# Altium schematic sheet NEOS_CAN.SchDoc: NEOS USB to CAN
size Tabloid; PageSetup: Record=PageOptions|CenterHorizontal=True|CenterVertical=True|PrintScale=0.51|XCorrection=1.00|YCorrection=1.00|PrintKind=1|BorderSize=5000000|LeftOffset=0|BottomOffset=0|Orientation=2|PaperLength=1000|PaperWidth=1000|Scale=100|PaperSource=15|PrintQuality=1200|MediaType=1|DitherType=10|PaperKind=11x17|PrintScaleMode=1
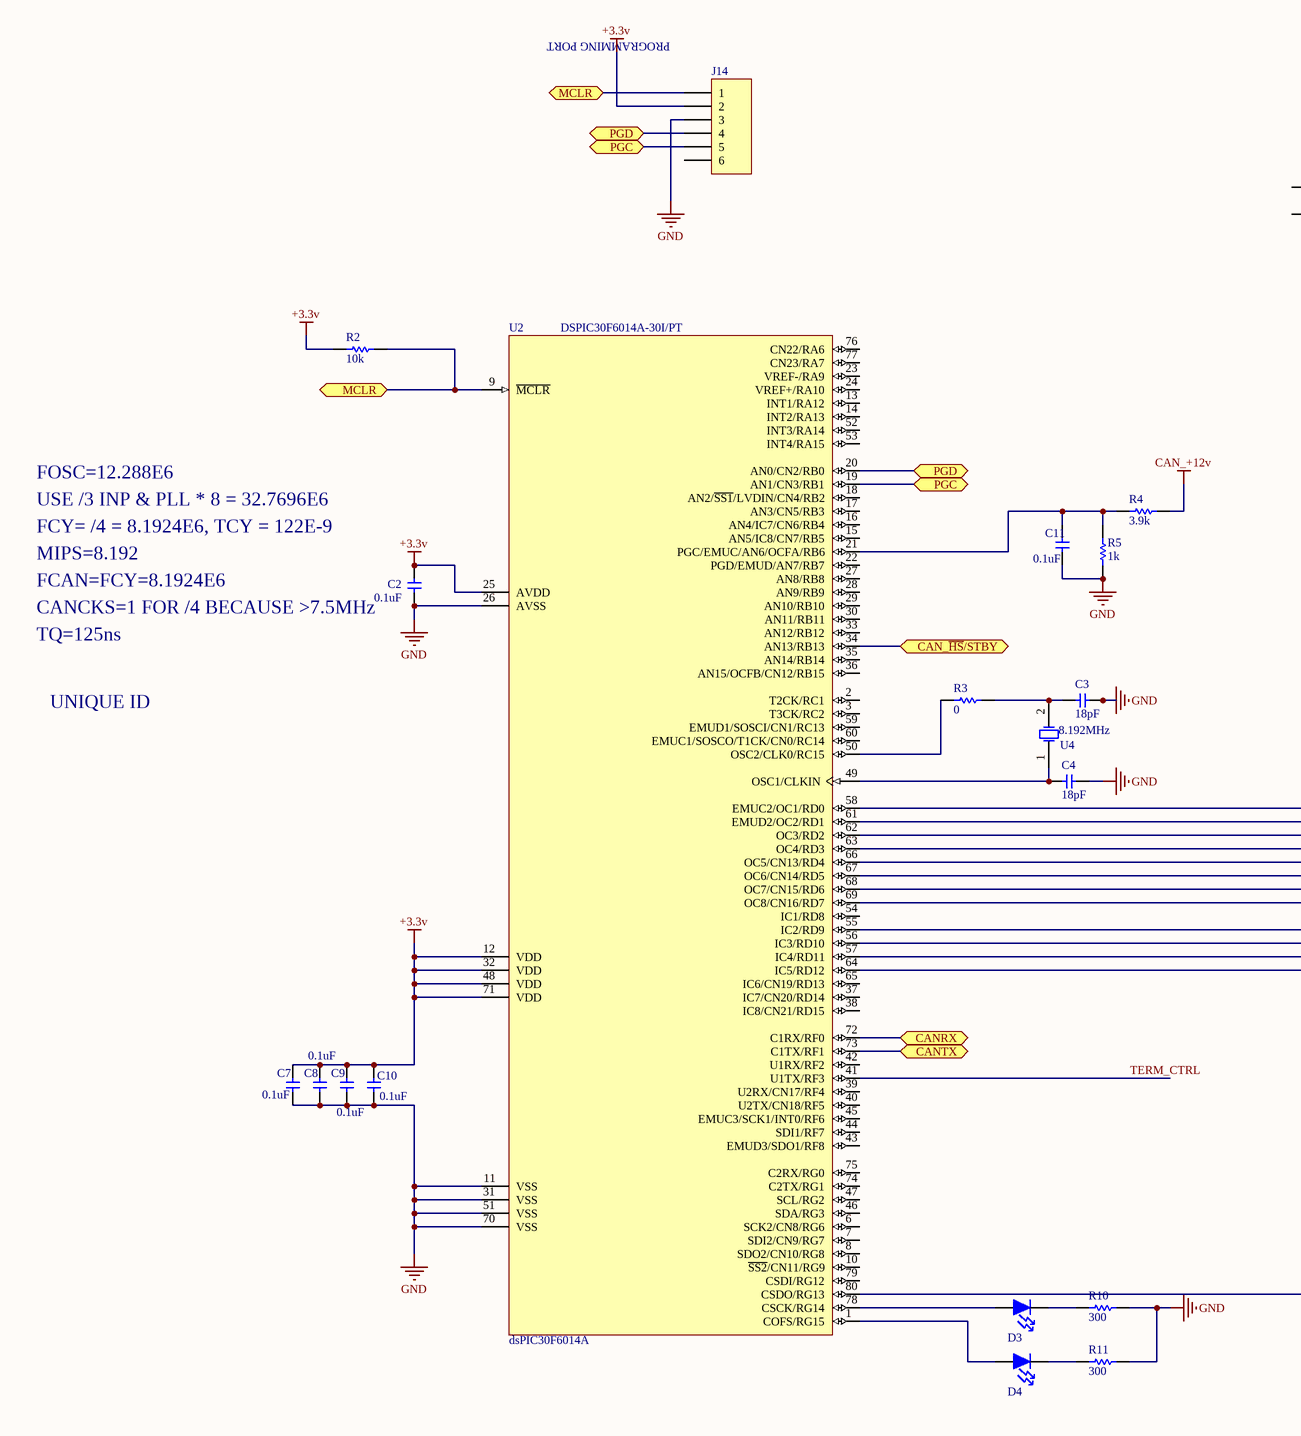
[diagram p0: NEOS_CAN.SchDoc, bottom left]
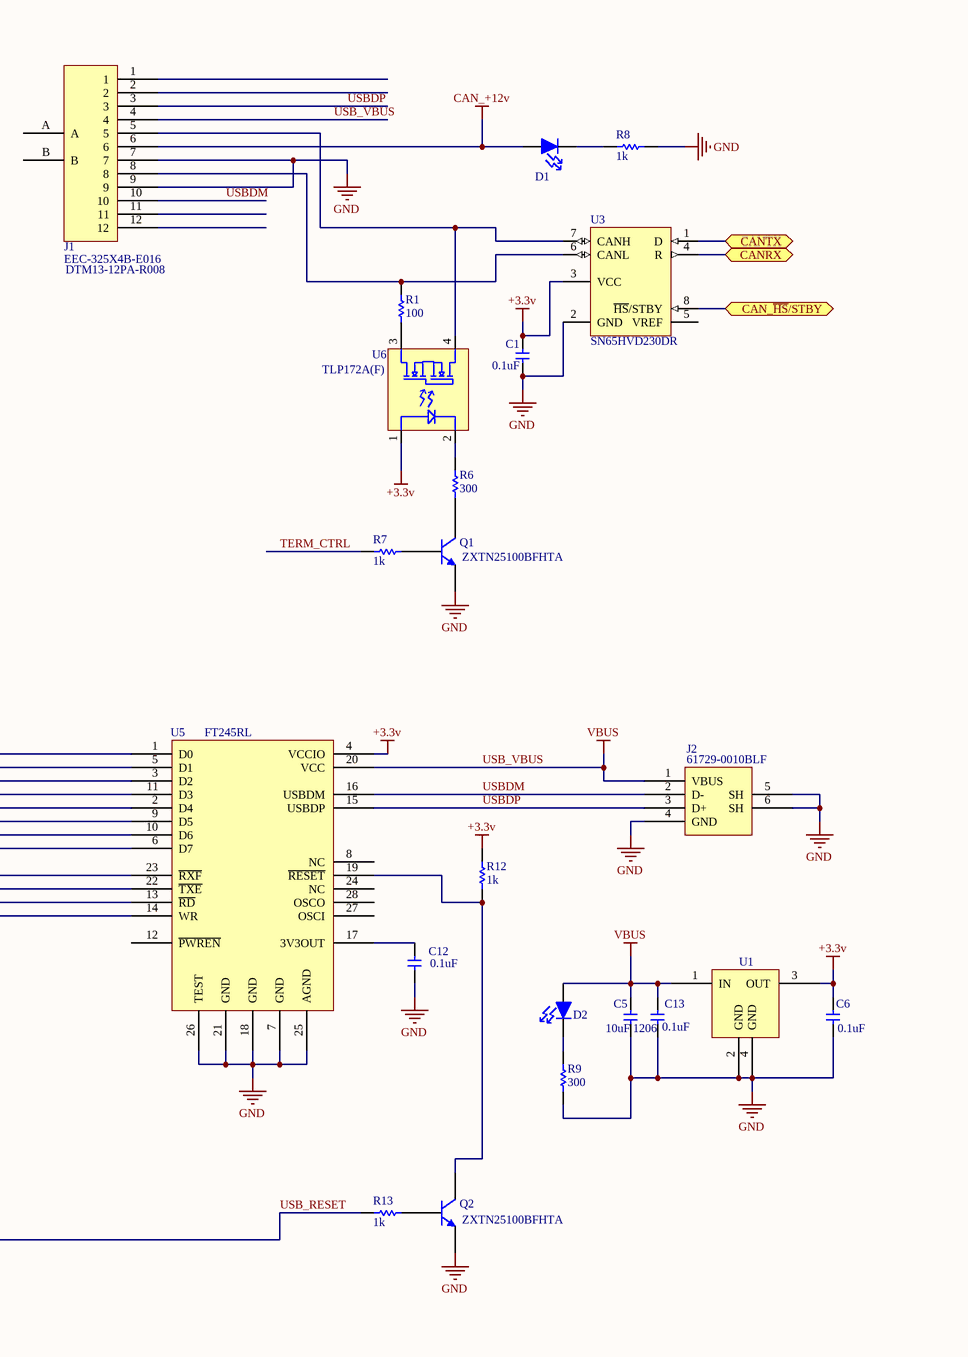
[diagram p1: NEOS_CAN.SchDoc, bottom middle]
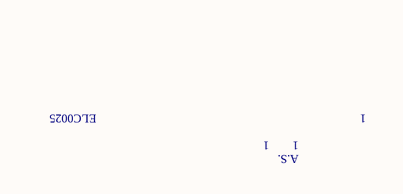
[diagram p2: NEOS_CAN.SchDoc, bottom right]

## Parts
C1  0.1uF  [0603]
C2  0.1uF  [0603]
C3  18pF  [0603]
C4  18pF  [0603]
C5  value 10uF 1206  [1206]  (hidden comment: C)
C6  value 0.1uF  [0805]  (hidden comment: C)
C7  0.1uF  [0603]
C8  0.1uF  [0603]
C9  0.1uF  [0603]
C10  0.1uF  [0603]
C11  0.1uF  [0805]
C12  value 0.1uF  [0805]  (hidden comment: C)
C13  value 0.1uF  [0805]  (hidden comment: C)
D1  LED_0805  [LED_0805]  (value not drawn)
D2  LED_0805  [LED_0805]  (value not drawn)
D3  LED_0805  [LED_0805]  (value not drawn)
D4  LED_0805  [LED_0805]  (value not drawn)
J1  Enclosure Part Number (Amber): EEC-325X4B-E016  [DTM13-12PA-R008]  (hidden comment: DT13-12PA-R008)
J2  Manufacturer Part Number: 61729-0010BLF  [1-1470156]  (hidden comment: CONN RCPT USB TYPE B R/A PCB)
J14  CONN HEADER VERT 6POS 5.08MM  [JCPM5086VE0Z]  (value not drawn)
Q1  ZXTN25100BFHTA  [SOT95P245X145-3L]
Q2  ZXTN25100BFHTA  [SOT95P245X145-3L]
R1  100  [0805]
R2  10k  [0603]
R3  0  [0805]
R4  3.9k  [0805]
R5  1k  [0805]
R6  value 300  [0805]  (hidden comment: R)
R7  1k  [0805]
R8  1k  [0805]
R9  value 300  [0805]  (hidden comment: R)
R10  300  [0805]
R11  300  [0805]
R12  1k  [0805]
R13  1k  [0805]
U1  LM2937  [SOT223]  (value not drawn)
U2  dsPIC30F6014A  Manufacturer Part Number: DSPIC30F6014A-30I/PT  [TQFP-80]
U3  SN65HVD230DR  [SOIC 8]
U4  8.192MHz  [HCM49]
U5  FT245RL  [SOP65P780X200-28L]
U6  Manufacturer Part Number: TLP172A(F)  [PS7241]  (hidden comment: TLP172A)

## Ports
CAN_~{HS}/STBY, CANRX, CANTX, MCLR, PGC, PGD

## Nets
+3.3v: C1.2 C2.2 C6.2 C7.2 C8.2 C9.2 C10.2 J14.2 R2.1 R12.1 U1.3(OUT) U2.12(VDD) U2.25(AVDD) U2.32(VDD) U2.48(VDD) U2.71(VDD) U3.3(VCC) U5.4(VCCIO) U6.1
CAN_+12v: D1.A J1.6 R4.2
GND: C1.1 C2.1 C3.1 C4.1 C5.1 C6.1 C7.1 C8.1 C9.1 C10.1 C11.1 C12.2 C13.1 J1.7 J1.9 J2.4(GND) J2.5(SH) J2.6(SH) J14.3 Q1.2(E) Q2.2(E) R5.1 R8.2 R9.1 R10.1 R11.1 U1.2(GND) U1.4(GND) U2.11(VSS) U2.26(AVSS) U2.31(VSS) U2.51(VSS) U2.70(VSS) U3.2(GND) U5.7(GND) U5.18(GND) U5.21(GND) U5.25(AGND) U5.26(TEST)
USB_VBUS: C5.2 C13.2 D2.A J1.4 J2.1(VBUS) U1.1(IN) U5.20(VCC)  [also labelled VBUS]
CAN_~{HS}/STBY: U2.34(AN13/RB13) U3.8(~{HS}/STBY) ; port CAN_~{HS}/STBY
CANRX: U2.72(C1RX/RF0) U3.4(R) ; port CANRX
CANTX: U2.73(C1TX/RF1) U3.1(D) ; port CANTX
MCLR: J14.1 R2.2 U2.9(~{MCLR}) ; port MCLR
PGC: J14.5 U2.19(AN1/CN3/RB1) ; port PGC
PGD: J14.4 U2.20(AN0/CN2/RB0) ; port PGD
TERM_CTRL: R7.2 U2.41(U1TX/RF3)
USB_RESET: R13.2 U2.80(CSDO/RG13)
USBDM: J1.10 J2.2(D-) U5.16(USBDM)
USBDP: J1.3 J2.3(D+) U5.15(USBDP)
NetC3_2: C3.2 R3.2 U4.2(OSC2)
NetC4_2: C4.2 U2.49(OSC1/CLKIN) U4.1(OSC1)
NetC11_2: C11.2 R4.1 R5.2 U2.21(PGC/EMUC/AN6/OCFA/RB6)
NetC12_1: C12.1 U5.17(3V3OUT)
NetD1_C: D1.C R8.1
NetD2_C: D2.C R9.2
NetD3_A: D3.A U2.78(CSCK/RG14)
NetD3_C: D3.C R10.2
NetD4_A: D4.A U2.1(COFS/RG15)
NetD4_C: D4.C R11.2
NetJ1_5: J1.5 U3.7(CANH) U6.4
NetJ1_8: J1.8 R1.2 U3.6(CANL)
NetQ1_1: Q1.1(B) R7.1
NetQ1_3: Q1.3(C) R6.1
NetQ2_1: Q2.1(B) R13.1
NetQ2_3: Q2.3(C) R12.2 U5.19(~{RESET})
NetR1_1: R1.1 U6.3
NetR3_1: R3.1 U2.50(OSC2/CLK0/RC15)
NetR6_2: R6.2 U6.2
NetU2_55: U2.55(IC2/RD9) U5.23(~{RXF})
NetU2_56: U2.56(IC3/RD10) U5.22(~{TXE})
NetU2_57: U2.57(IC4/RD11) U5.13(~{RD})
NetU2_58: U2.58(EMUC2/OC1/RD0) U5.1(D0)
NetU2_61: U2.61(EMUD2/OC2/RD1) U5.5(D1)
NetU2_62: U2.62(OC3/RD2) U5.3(D2)
NetU2_63: U2.63(OC4/RD3) U5.11(D3)
NetU2_64: U2.64(IC5/RD12) U5.14(WR)
NetU2_66: U2.66(OC5/CN13/RD4) U5.2(D4)
NetU2_67: U2.67(OC6/CN14/RD5) U5.9(D5)
NetU2_68: U2.68(OC7/CN15/RD6) U5.10(D6)
NetU2_69: U2.69(OC8/CN16/RD7) U5.6(D7)

Not connected (* = marked no-connect by the designer): J1 1 2 11 12 A B; J14 6; U2 2(T2CK/RC1) 3(T3CK/RC2) 6(SCK2/CN8/RG6) 7(SDI2/CN9/RG7) 8(SDO2/CN10/RG8) 10(~{SS2}/CN11/RG9) 13(INT1/RA12) 14(INT2/RA13) 15(AN5/IC8/CN7/RB5) 16(AN4/IC7/CN6/RB4) 17(AN3/CN5/RB3) 18(AN2/~{SS1}/LVDIN/CN4/RB2) 22(PGD/EMUD/AN7/RB7) 23(VREF-/RA9) 24(VREF+/RA10) 27(AN8/RB8) 28(AN9/RB9) 29(AN10/RB10) 30(AN11/RB11) 33(AN12/RB12) 35(AN14/RB14) 36(AN15/OCFB/CN12/RB15) 37(IC7/CN20/RD14) 38(IC8/CN21/RD15) 39(U2RX/CN17/RF4) 40(U2TX/CN18/RF5) 42(U1RX/RF2) 43(EMUD3/SDO1/RF8) 44(SDI1/RF7) 45(EMUC3/SCK1/INT0/RF6) 46(SDA/RG3) 47(SCL/RG2) 52(INT3/RA14) 53(INT4/RA15) 54(IC1/RD8) 59(EMUD1/SOSCI/CN1/RC13) 60(EMUC1/SOSCO/T1CK/CN0/RC14) 65(IC6/CN19/RD13) 74(C2TX/RG1) 75(C2RX/RG0) 76(CN22/RA6) 77(CN23/RA7) 79(CSDI/RG12); U3 5(VREF); U5 8(NC) 12(~{PWREN}) 24(NC) 27(OSCI) 28(OSCO)

## Notes on the sheet
- (near J14) PROGRAMMING PORT
- FOSC=12.288E6
- USE /3 INP & PLL * 8 = 32.7696E6
- FCY= /4 = 8.1924E6, TCY = 122E-9
- MIPS=8.192
- FCAN=FCY=8.1924E6
- CANCKS=1 FOR /4 BECAUSE >7.5MHz
- TQ=125ns
- UNIQUE ID
- ELC0025
- 1
- A.S.

## Library data of the parts
C1 C2 C7-C11 = C: Manufacturer: Murata Electronics North America; Manufacturer Part Number: GRM188R71C104KA01D; Source Part Number: 490-1532-1-ND; ROHS Certificate: ROHS-MURATA-CHIP-CAPS.pdf; Value: 0.1uF
  C1 C2 C7-C10: Source: Digikey
  C11: Source: DIGIKEY
C3 = C: CAP CER 18PF 50V 5% C0G 0603; Manufacturer: Murata Electronics North America; Manufacturer Part Number: GRM1885C1H180JA01D; Source Part Number: 490-1409-1-ND; Source: Digikey; ROHS Certificate: ROHS-MURATA-CHIP-CAPS.pdf; Value: 18pF
C4 = C: CAP CER 18PF 50V 5% C0G 0603; Manufacturer: Murata Electronics North America; Source Part Number: 490-1409-1-ND; Manufacturer Part Number: CAP CER 18PF 50V 5% C0G 0603; Source: Digikey; ROHS Certificate: ROHS-MURATA-CHIP-CAPS.pdf; Value: 18pF
C5 = C: 10uF 1206; Manufacturer: Murata Electronics North America; Manufacturer Part Number: GRM31CF51E106ZA01L; Source Part Number: 490-3382-1-ND; Source: Digikey; ROHS Certificate: ROHS-MURATA-CHIP-CAPS.pdf
C6 C12 C13 = C: 0.1uF; Manufacturer: Murata Electronics North America; Manufacturer Part Number: GRM188R71C104KA01D; Source Part Number: 490-1532-1-ND; Source: Digikey; ROHS Certificate: ROHS-MURATA-CHIP-CAPS.pdf
D1-D4 = LED_0805: LED ALINGAP RED CLEAR 0805 SMD; Manufacturer: Dialight; Manufacturer Part Number: 598-8110-107F; Source: Digikey; Source Part Number: 598-8110-107F; ROHS Certificate: ROHS-DIALIGHT.pdf; Value: LED ALINGAP RED CLEAR 0805 SMD
J1 = DT13-12PA-R008: DTM13-12PA-R008; Manufacturer: Duetsch IPD; Enclosure Part Number: EEC-325X4A; Manufacturer Part Number: DTM13-12PA-R008; Source: Ladd Industries; Source Part Number: DTM13-12PA-R008; Value: DTM13-12PA-R008
J2 = USB_TYPEB: USB TYPE B R/A PCB; Manufacturer: FCI; Source Part Number: 609-1039-ND; Source: Digikey; ROHS Certificate: ROHS-FCI_61729-0010BLF; Value: CONN RCPT USB TYPE B R/A PCB
J14 = 1758050 - Phoenix 6 Pin Vert. 5.08mm: Manufacturer: Phoenix Contact; Source Part Number: 277-1132-ND; Manufacturer Part Number: 1758050; Source: Digikey; ROHS Certificate: ROHS-PHOENIX.pdf; Value: CONN HEADER VERT 6POS 5.08MM
Q1 Q2 = NPN_SOT23: TRANSISTOR NPN 100V 3A SOT-23; Manufacturer: Zetex Inc; Source Part Number: ZXTN25100BFHCT-ND; Manufacturer Part Number: ZXTN25100BFHTA; Source: Digikey; ROHS Certificate: ROHS-ZETEX.pdf; Value: TRANSISTOR NPN 100V 3A SOT-23
R1 = R: Manufacturer: Yageo; Manufacturer Part Number: RC0805FR-07100RL; Source Part Number: 311-100CRCT-ND; Source: Digikey; ROHS Certificate: ROHS-YAGEO.pdf; Value: 100
R2 R5 R7 R8 R13 = R: Manufacturer: Yageo; Manufacturer Part Number: RC0805FR-071KL; Source Part Number: 311-1.00KCRCT-ND; Source: Digikey; ROHS Certificate: ROHS-YAGEO.pdf
  R2: Value: 10k
  R5 R7 R8 R13: Value: 1k
R3 = R: Manufacturer: Yageo; Manufacturer Part Number: RC0603JR-070RL; Source Part Number: 311-0.0GRCT-ND; Source: Digikey; ROHS Certificate: ROHS-YAGEO.pdf; Value: 0
R4 = R: Manufacturer: Yageo; Manufacturer Part Number: RC0805FR-073K9L; Source Part Number: 311-3.90KCRCT-ND; Source: Digikey; ROHS Certificate: ROHS-YAGEO.pdf; Value: 3.9k
R6 R9 = R: 300; Manufacturer: Yageo; Manufacturer Part Number: RC0805FR-07300RL; Source Part Number: 311-300CRCT-ND; Source: Digikey; ROHS Certificate: ROHS-YAGEO.pdf
R10 R11 = R: Manufacturer: Yageo; Manufacturer Part Number: RC0805FR-07300RL; Source Part Number: 311-300CRCT-ND; Source: Digikey; ROHS Certificate: ROHS-YAGEO.pdf; Value: 300
R12 = R: Manufacturer: Panasonic - ECG; Manufacturer Part Number: RC0805FR-071KL; Source Part Number: 311-1.00KCRCT-ND; Source: Digikey; ROHS Certificate: ROHS-PANASONIC.pdf; Value: 1k
U1 = LM2937: IC REG LDO 500MA 3.3V SOT-223; Manufacturer: National Semiconductor; Manufacturer Part Number: LM2937IMP-3.3/NOPB; Source Part Number: LM2937IMP-3.3CT-ND; Source: Digikey; Value: IC REG LDO 500MA 3.3V SOT-223; ROHS Certificate: ROHS-LM2937IMP-3.3-NOPB.pdf
U2 = DSPIC30F6014: Microchip dsPIC30F6014 80-TQFP; Source Part Number: DSPIC30F6014A30IP-ND; Manufacturer: Microchip Technology; Value: IC DSPIC MCU/DSP 144K 80TQFP; ROHS Certificate: ROHS-MICROCHIP.pdf; Source: Digikey
U3 = SN65HVD230DR: IC 3.3V CAN TXRX W/STNDBY 8-SOIC; Manufacturer: Texas Instruments; Source Part Number: 296-11654-1-ND; Source: Digikey; ROHS Certificate: ROHS-SNHVD230.pdf; Value: IC 3.3V CAN TXRX W/STNDBY 8-SOIC; Manufacturer Part Number: SN65HVD230DR
U4 = CRYSTAL: CRYSTAL 12.288 MHZ SMT 18PF; Manufacturer: Citizen America Corporation - Component Sales Division; Manufacturer Part Number: HCM49 12.288MABJ-UT; Source Part Number: 300-8550-1-ND; Source: Digikey; ROHS Certificate: ROHS-CITIZEN.pdf; Value: CRYSTAL 12.288 MHZ SMT 18PF
U5 = FT245RL: USB Interface ICs USB TO PARALLEL FIFO 28 PIN SSOP; Manufacturer: FTDI; Source Part Number: 895-FT245RL; Manufacturer Part Number: FT245RL; Source: Mouser; ROHS Certificate: ROHS-FTDI.pdf; Value: FT245RL
U6 = TLP172A: PHOTOCOUPLER PHOTORELAY 4-SOP; Manufacturer: Toshiba; Source Part Number: TLP172AF-ND; Value: TLP172AF-ND; Source: Digikey; ROHS Certificate: ROHS-TOSHIBA